# EAGLE design stokes_polarimeter_oled (EAGLE 9.6.2)
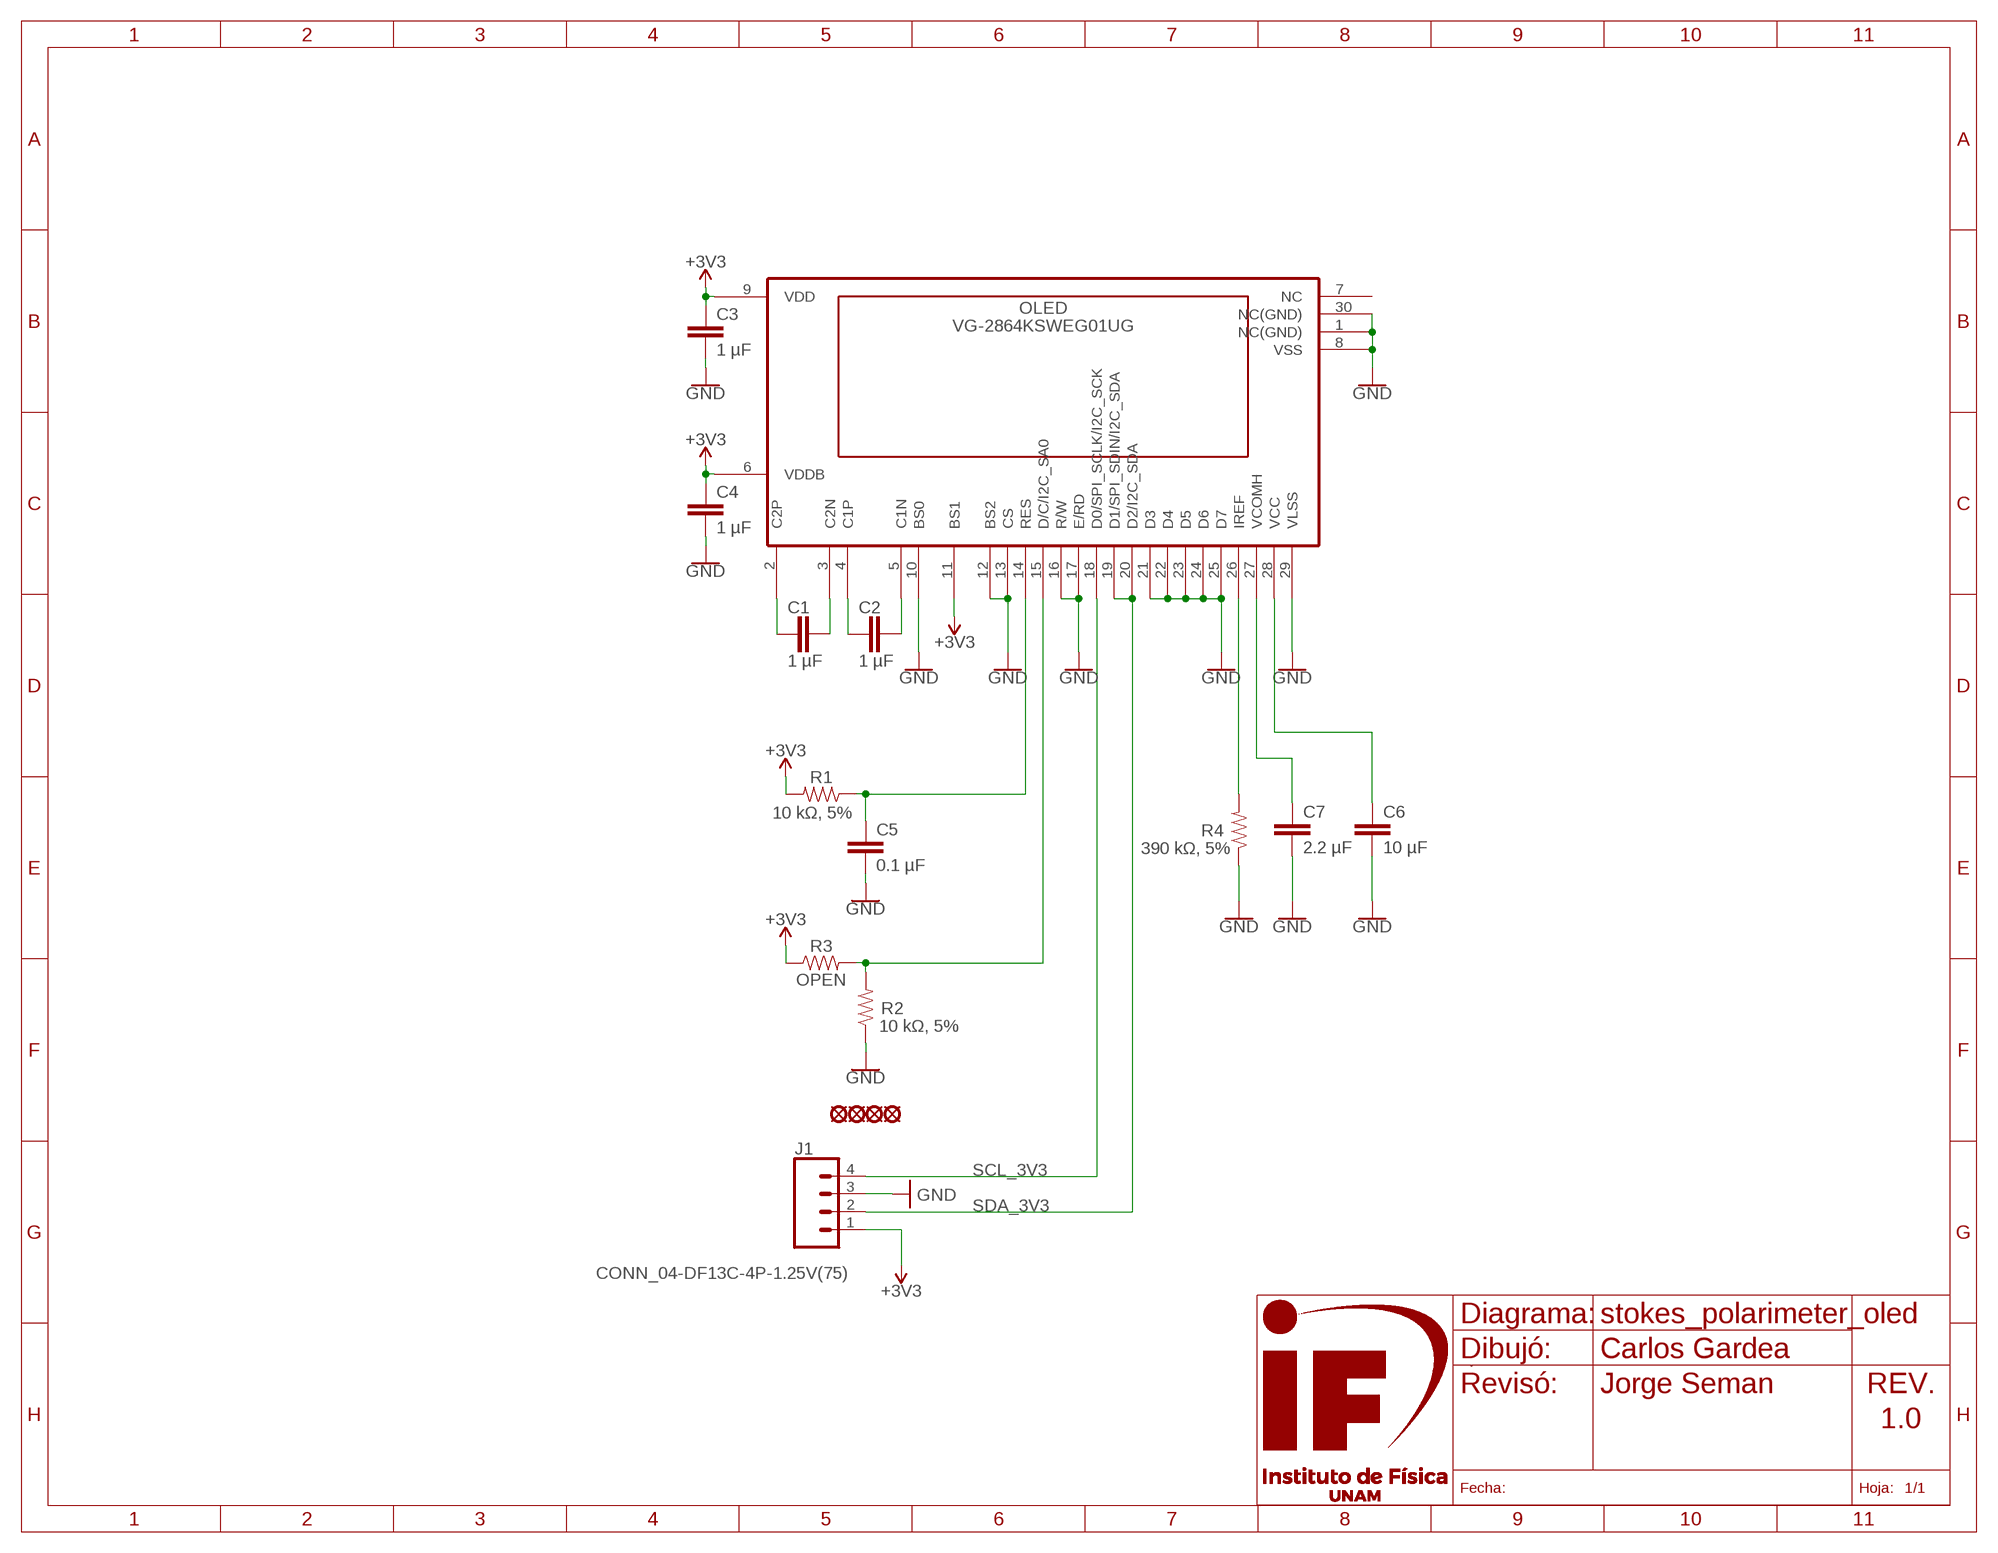
[diagram p0: schematic, sheet 1]

## Parts
C1  1 µF  1µF-C1206C105K3RACTU  [C1206]
C2  1 µF  1µF-C1206C105K3RACTU  [C1206]
C3  1 µF  1µF-C1206C105K3RACTU  [C1206]
C4  1 µF  1µF-C1206C105K3RACTU  [C1206]
C5  0.1 µF  0.1µF-C1206C104J1RACTU  [C1206]
C6  10 µF  10µF-C1206C106K4PACTU  [C1206]
C7  2.2 µF  2.2µF-C1206C225K4PACTU  [C1206]
H5  HOLE-M2.5  [HOLE_2.5]
H6  HOLE-M2.5  [HOLE_2.5]
H7  HOLE-M2.5  [HOLE_2.5]
H8  HOLE-M2.5  [HOLE_2.5]
J1  CONN_04-DF13C-4P-1.25V(75)  [DF13C4P125V]
OLED  VG-2864KSWEG01UG  [UG-2864HSWEG01]
R1  10 kΩ, 5%  10KΩ-RC1206JR-0710KL  [R1206]
R2  10 kΩ, 5%  10KΩ-RC1206JR-0710KL  [R1206]
R3  OPEN  [R1206_OPEN]
R4  390 kΩ, 5%  390KΩ-RC1206JR-07390KL  [R1206]
U$1  IFUNAM_FRAME_LETTER_HNONE  [NONE]

## Nets
+3V3: C3.1 C4.1 J1.1 OLED.6(VDDB) OLED.9(VDD) OLED.11(BS1) R1.2 R3.1
GND: C3.2 C4.2 C5.2 C6.2 C7.2 J1.3 OLED.1(NC(GND)) OLED.8(VSS) OLED.10(BS0) OLED.12(BS2) OLED.13(CS) OLED.16(R/W) OLED.17(E/RD) OLED.21(D3) OLED.22(D4) OLED.23(D5) OLED.24(D6) OLED.25(D7) OLED.29(VLSS) OLED.30(NC(GND)) R2.1 R4.1
N$1: C2.1 OLED.4(C1P)
N$2: C1.2 OLED.3(C2N)
N$3: C1.1 OLED.2(C2P)
N$5: C2.2 OLED.5(C1N)
N$6: C5.1 OLED.14(RES) R1.1
N$7: OLED.15(D/C/I2C_SA0) R2.2 R3.2
N$8: OLED.26(IREF) R4.2
N$9: C7.1 OLED.27(VCOMH)
N$10: C6.1 OLED.28(VCC)
SCL_3V3: J1.4 OLED.18(D0/SPI_SCLK/I2C_SCK)
SDA_3V3: J1.2 OLED.19(D1/SPI_SDIN/I2C_SDA) OLED.20(D2/I2C_SDA)
Unconnected: OLED.7(NC)

## Library data of the parts
C1-C4 = IFUNAM-Capacitors:1µF: 1 µF Film Capacitor; DIGIKEY#: 399-1255-1-ND; MFR: KEMET; MFR#: C1206C105K3RACTU
C5 = IFUNAM-Capacitors:0.1µF: 0.1 µF Ceramic Capacitor; DIGIKEY#: 399-9304-1-ND; MFR: KEMET; MFR#: C1206C104J1RACTU
C6 = IFUNAM-Capacitors:10µF: 10 µF Film Capacitor; DIGIKEY#: 399-5091-1-ND; MFR: KEMET; MFR#: C1206C106K4PACTU
C7 = IFUNAM-Capacitors:2.2µF: 2.2 µF Film Capacitor; DIGIKEY#: 399-1263-1-ND; MFR: KEMET; MFR#: C1206C225K4PACTU
H5-H8 = untitled:HOLE: Hole
J1 = IFUNAM-Connectors:CONN_04: 4 Position Connector; MFR: Hirose Connector; MFR#: DF13C-4P-1.25V(75); MOUSER#: 798-DF13C-4P-1.25V75
OLED = IFUNAM-Oled:VG-2864KSWEG01: No description set
R1 R2 = IFUNAM-Resistors:10KΩ: Resistor, 10 kΩ; MFR: Yageo; MFR#: RC1206JR-0710KL; MOUSER#: 603-RC1206JR-0710KL
R3 = IFUNAM-Resistors:OPEN: OPEN; DIGIKEY#: NA; MFR: NA; MFR#: NA
R4 = IFUNAM-Resistors:390KΩ: Thick Film Resistors - SMD 390K OHM 5%; MFR: Yageo; MFR#: RC1206JR-07390KL; MOUSER#: 603-RC1206JR-07390KL
U$1 = IFUNAM-Art:IFUNAM_FRAME_LETTER_H: Frame LETTER; AUTHOR: Carlos Gardea; REV: 1.0; REVISOR: Jorge Seman

## Board
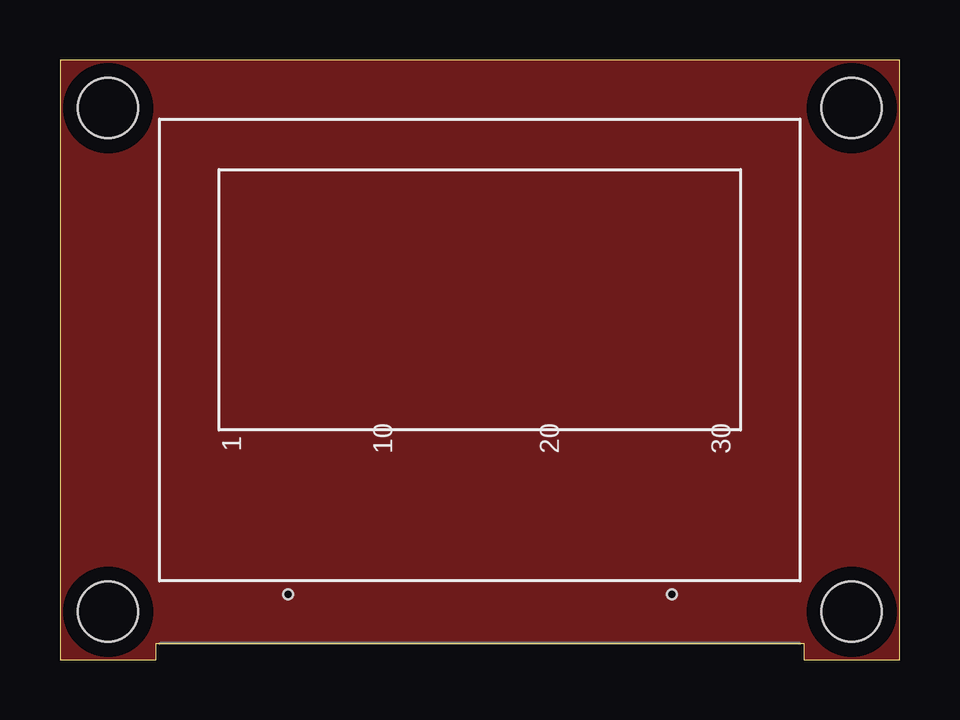
[diagram p1: board, top side]
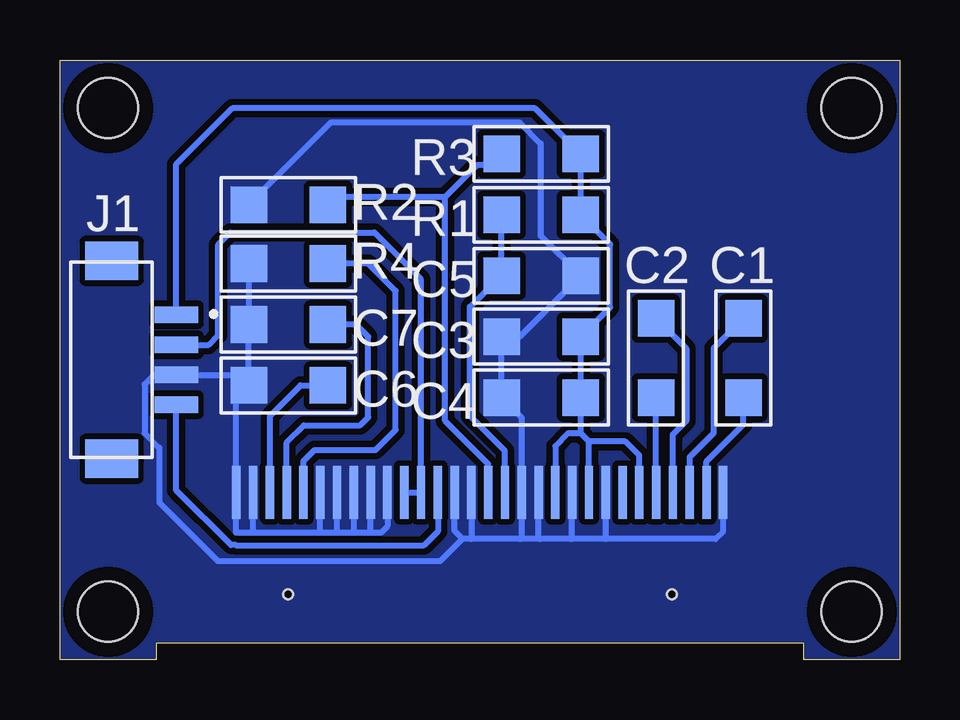
[diagram p2: board, bottom side, seen from below]

Size 35 x 25 mm. Coordinates in mm from the lower left corner, seen from the top.
Outline: 0,0 4,0 4,0.67 31,0.67 31,0 35,0 35,25 0,25 0,0
Copper layers (1*16): Top 0.035mm / dielectric 1.5mm / Bottom 0.035mm
Design rules "default *": minimum track width 6mil, minimum drill 0.3mm, track to track 10mil, track to pad 10mil, pad to pad 10mil, via to via 10mil, smd to smd 10mil, copper to edge 0mil, drill to drill 6mil, minimum pad ring 10mil, minimum via ring 1mil, stop-mask expansion 4mil, vias tented up to drill 0mil, thermal gap 10mil

### Footprints (pad centres in the part's own frame; a part is rotated, then mirrored left to right if it is on the bottom)
C1206 = smd 1.524 x 1.524: 1 -1.651,0; 2 1.651,0
HOLE_2.5 = hole 2.5: 0,0
DF13C4P125V = smd 0.7 x 1.8: 1 -1.875,2.7; 2 -0.625,2.7; 3 0.625,2.7; 4 1.875,2.7 | smd 1.6 x 2.2: MP1 -4.125,0; MP2 4.125,0
UG-2864HSWEG01 = smd 0.35 x 2.2 bottom: 1 -10.15,-1.2; 2 -9.45,-1.2; 3 -8.75,-1.2; 4 -8.05,-1.2; 5 -7.35,-1.2; 6 -6.65,-1.2; 7 -5.95,-1.2; 8 -5.25,-1.2; 9 -4.55,-1.2; 10 -3.85,-1.2; 11 -3.15,-1.2; 12 -2.45,-1.2; 13 -1.75,-1.2; 14 -1.05,-1.2; 15 -0.35,-1.2; 16 0.35,-1.2; 17 1.05,-1.2; 18 1.75,-1.2; 19 2.45,-1.2; 20 3.15,-1.2; 21 3.85,-1.2; 22 4.55,-1.2; 23 5.25,-1.2; 24 5.95,-1.2; 25 6.65,-1.2; 26 7.35,-1.2; 27 8.05,-1.2; 28 8.75,-1.2; 29 9.45,-1.2; 30 10.15,-1.2 | hole 0.4: -8,-5.45; 8,-5.45
R1206 = smd 1.524 x 1.524: 1 -1.651,0; 2 1.651,0
R1206_OPEN = smd 1.524 x 1.524: 1 -1.651,0; 2 1.651,0

### Placement (x,y rotation side)
C1  6.51,12.57 90 bottom
C2  10.15,12.57 270 bottom
C3  14.94,13.46 180 bottom
C4  14.94,10.92 180 bottom
C5  14.94,16 0 bottom
C6  25.48,11.43 180 bottom
C7  25.48,13.97 180 bottom
H5  2,23 0 top
H6  2,2 0 top
H7  33,2 0 top
H8  33,23 0 top
J1  32.85,12.5 270 bottom
OLED  17.5,8.17 0 top
R1  14.94,18.54 0 bottom
R2  25.48,18.96 0 bottom
R3  14.94,21.08 180 bottom
R4  25.48,16.51 0 bottom
U$1  17.5,8.17 0 top

### Tracks (layer width: path | path; a pad name or v marks a point on that pad's centre or on a via)
+3V3
  Bottom 0.254: OLED.6 10.85,8.51 11.43,9.09 12.95,9.09 | OLED.9 12.95,9.09 | OLED.11 14.35,8.9 13.81,9.43 13.29,9.43 | 12.95,9.09 13.29,9.43 | 13.29,9.43 C4.1 C3.1 12.07,14.68 12.07,17.32 R1.2 R3.1 15.19,22.98 27.82,22.98 30.15,20.66 J1.1
GND
  Bottom 0.254: OLED.1 7.35,5.35 7.68,5.03 12.25,5.03 | 12.25,5.03 13.69,5.03 | 13.69,5.03 14.99,5.03 | 14.99,5.03 15.8,5.03 | 15.8,5.03 17.86,5.03 | 17.86,5.03 18.22,5.03 | 22.05,5.28 22.75,5.28 | 22.75,5.28 23.45,5.28 | 23.45,5.28 24.16,5.28 | 24.16,5.28 26.95,5.28 | 12.25,5.03 OLED.8 | 13.69,5.03 13.65,5.07 OLED.10 | 14.99,5.03 15.05,5.09 OLED.12 | 15.8,5.03 15.75,5.08 OLED.13 15.75,10.08 C4.2 C3.2 15.83,13.46 C5.2 14.96,17.67 14.96,21.52 15.84,22.4 23.7,22.4 R2.1 | 22.05,5.28 OLED.22 | 22.75,5.28 OLED.23 | 23.45,5.28 OLED.24 | 24.16,5.28 OLED.25 | 26.95,5.28 OLED.29 | R4.1 C7.2 C6.2 | C6.2 27.65,10.91 OLED.30 27.66,6.96 27.66,5.28 26.95,5.28 | 18.22,5.03 18.55,5.36 OLED.17 | OLED.16 17.85,5.04 17.86,5.03 | OLED.21 21.35,5.55 21.62,5.28 22.05,5.28 | C6.2 27.58,11.88 J1.3 31.07,11.88 31.47,11.47 31.47,9.44 30.86,8.83 30.86,6.54 28.42,4.11 19.14,4.11 18.22,5.03
  pour Bottom (no thermals): 0,25 0,0 4,0 4,0.67 31,0.67 31,0 35,0 35,25
N$1
  Bottom 0.254: OLED.4 9.45,9.39 8.89,9.94 8.89,12.96 C2.1
N$2
  Bottom 0.254: OLED.3 8.75,8.45 7.76,9.44 7.76,12.97 C1.2
N$3
  Bottom 0.254: OLED.2 8.05,8.26 6.51,9.8 C1.1
N$4
  pour Top: 35,0 31,0 31,0.67 4,0.67 4,0 0,0 0,25 35,25
N$5
  Bottom 0.254: OLED.5 C2.2
N$6
  Bottom 0.254: OLED.14 16.45,8.7 17.91,10.16 17.91,14.71 16.59,16.03 | C5.1 16.59,16.03 | 16.59,16.03 R1.1
N$7
  Bottom 0.254: OLED.15 17.15,8.16 18.95,9.95 18.95,19.29 | 18.95,19.29 23.5,19.29 R2.2 | 18.95,19.29 17.61,20.62 17.05,20.62 R3.2
N$8
  Bottom 0.254: OLED.26 24.85,8.28 24.39,8.74 21.85,8.74 21.01,9.58 21.01,15.37 22.15,16.51 R4.2
N$9
  Bottom 0.254: OLED.27 25.55,9.05 24.83,9.77 22.48,9.77 22.15,10.1 22.15,13.46 22.66,13.97 C7.1
N$10
  Bottom 0.254: OLED.28 26.25,10.15 24.97,11.43 C6.1
SCL_3V3
  Bottom 0.254: OLED.18 19.25,5.34 19.83,4.76 27.66,4.76 27.67,4.78 27.88,4.78 30.15,7.05 J1.4
SDA_3V3
  Bottom 0.254: OLED.20 OLED.19 19.95,15.86 21.89,17.8 27.9,17.8 28.41,17.3 28.41,13.52 28.8,13.12 J1.2